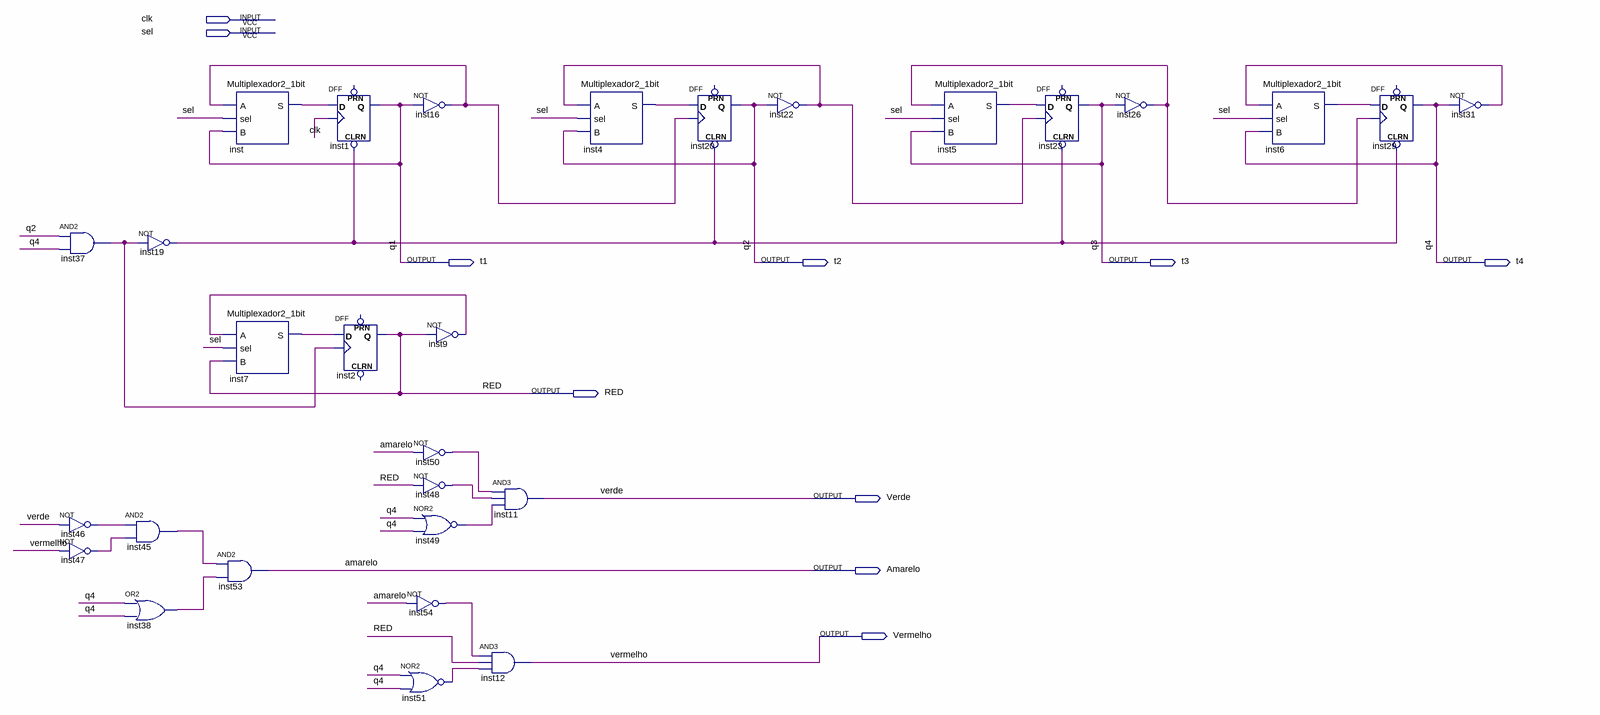
[diagram p0: schematic sheet]
// Quartus schematic LAB_FSM.bdf as structural Verilog: 29 symbols, 10 pins
module LAB_FSM (
  input  clk,
  input  sel,
  output t1,
  output t2,
  output t3,
  output t4,
  output RED,
  output Verde,
  output Amarelo,
  output Vermelho
);

  wire inst4_s, inst5_s, inst6_s, inst7_s, inst9_out, inst16_out, inst19_out, inst22_out, inst26_out,
       inst31_out, inst37_out, inst38_out, inst45_out, inst46_out, inst47_out, inst48_out, inst49_out,
       inst50_out, inst51_out, inst54_out, inst_s;

  and inst37 (inst37_out, t2, t4);
  not inst46 (inst46_out, Verde);
  not inst47 (inst47_out, Vermelho);
  not inst19 (inst19_out, inst37_out);
  and inst45 (inst45_out, inst46_out, inst47_out);
  or inst38 (inst38_out, t4, t4);
  Multiplexador2_1bit inst (.A(inst16_out), .sel(sel), .B(t1), .S(inst_s));
  Multiplexador2_1bit inst7 (.A(inst9_out), .sel(sel), .B(RED), .S(inst7_s));
  and inst53 (Amarelo, inst45_out, inst38_out);
  DFF inst1 (.CLRN(inst19_out), .CLK(clk), .D(inst_s), .Q(t1));  // open: PRN
  DFF inst2 (.CLK(inst37_out), .D(inst7_s), .Q(RED));  // open: CLRN, PRN
  not inst16 (inst16_out, t1);
  not inst50 (inst50_out, Amarelo);
  not inst48 (inst48_out, RED);
  nor inst49 (inst49_out, t4, t4);
  not inst54 (inst54_out, Amarelo);
  nor inst51 (inst51_out, t4, t4);
  not inst9 (inst9_out, RED);
  and inst11 (Verde, inst50_out, inst48_out, inst49_out);
  and inst12 (Vermelho, inst54_out, RED, inst51_out);
  Multiplexador2_1bit inst4 (.A(inst22_out), .sel(sel), .B(t2), .S(inst4_s));
  DFF inst20 (.CLRN(inst19_out), .CLK(inst16_out), .D(inst4_s), .Q(t2));  // open: PRN
  not inst22 (inst22_out, t2);
  Multiplexador2_1bit inst5 (.A(inst26_out), .sel(sel), .B(t3), .S(inst5_s));
  DFF inst23 (.CLRN(inst19_out), .CLK(inst22_out), .D(inst5_s), .Q(t3));  // open: PRN
  not inst26 (inst26_out, t3);
  Multiplexador2_1bit inst6 (.A(inst31_out), .sel(sel), .B(t4), .S(inst6_s));
  DFF inst29 (.CLRN(inst19_out), .CLK(inst26_out), .D(inst6_s), .Q(t4));  // open: PRN
  not inst31 (inst31_out, t4);

  // Other names for the same wires on the sheet: q1 = t1; q2 = t2; q3 = t3; q4 = t4
endmodule
